# Altium schematic sheet ESP8266_Amp_THT.SchDoc
size A4; PageSetup: Record=PageOptions|CenterHorizontal=True|CenterVertical=True|PrintScale=1.00|XCorrection=1.00|YCorrection=1.00|PrintKind=1|BorderSize=5000000|LeftOffset=0|BottomOffset=0|Orientation=2|PaperLength=1000|PaperWidth=1000|Scale=100|PaperSource=7|PrintQuality=600|MediaType=1|DitherType=10|PrintScaleMode=1|PaperKind=A4|PaperIndex=9
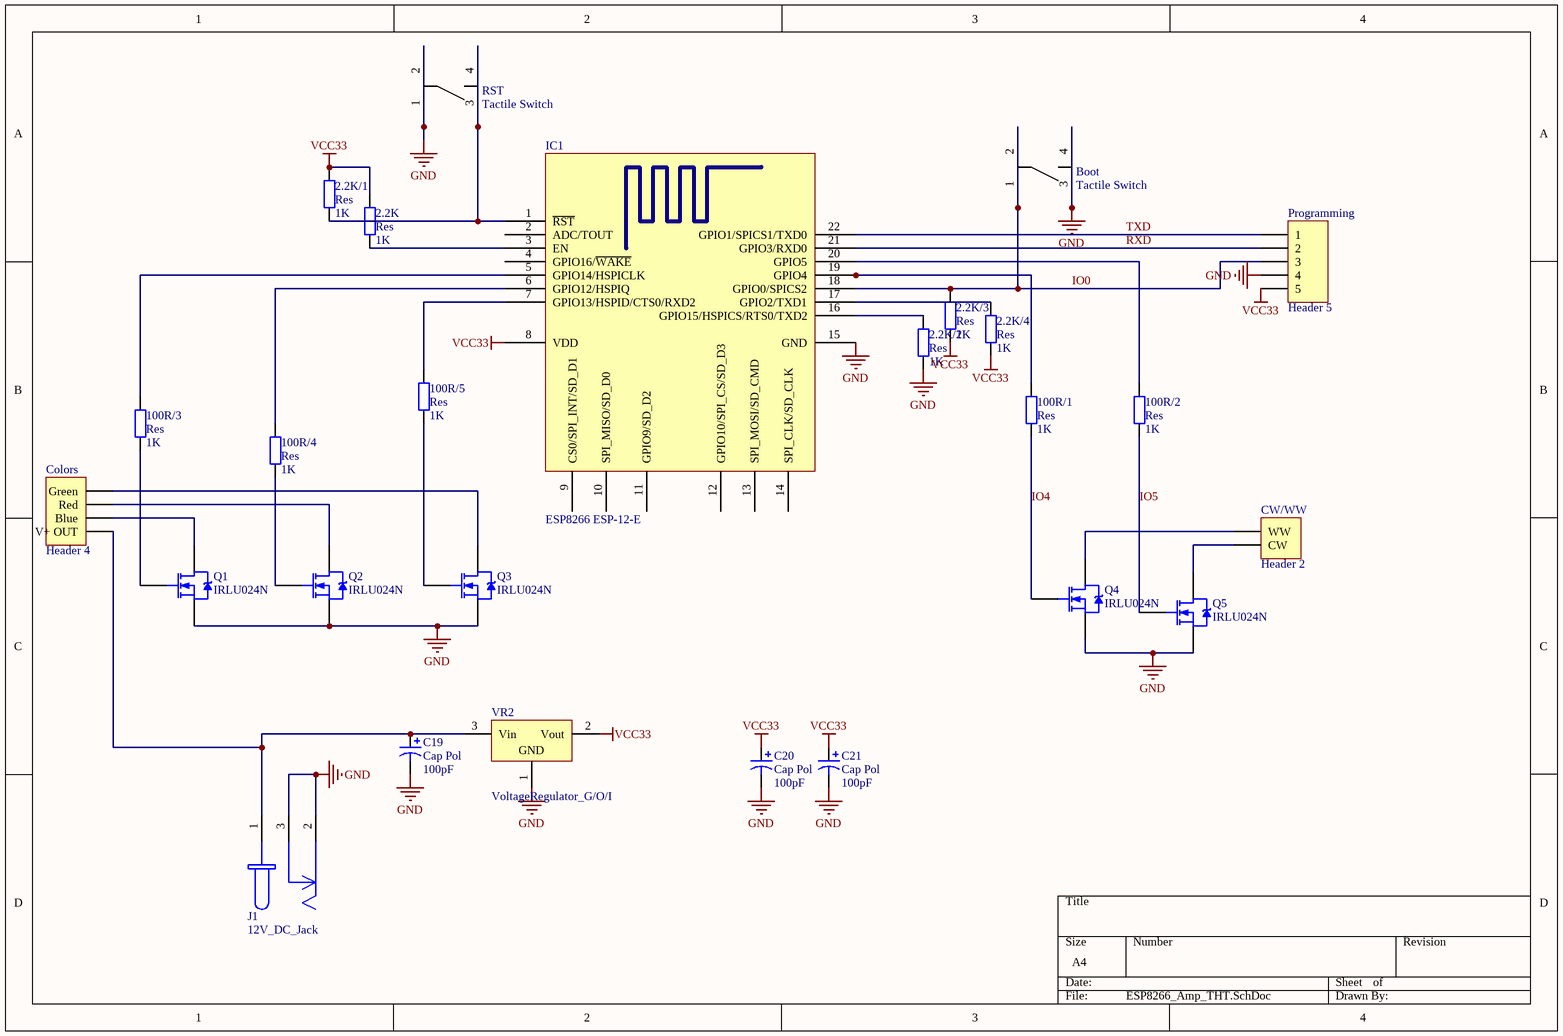
[diagram p0: ESP8266_Amp_THT.SchDoc]

## Parts
2.2K  Res  value 1K  [Res-1/4W]
2.2K/1  Res  value 1K  [Res-1/4W]
2.2K/2  Res  value 1K  [Res-1/4W]
2.2K/3  Res  value 1K  [Res-1/4W]
2.2K/4  Res  value 1K  [Res-1/4W]
100R/1  Res  value 1K  [Res-1/4W]
100R/2  Res  value 1K  [Res-1/4W]
100R/3  Res  value 1K  [Res-1/4W]
100R/4  Res  value 1K  [Res-1/4W]
100R/5  Res  value 1K  [Res-1/4W]
Boot  Tactile Switch  [Tactile-SW]
C19  Cap Pol  value 100pF  [CAPR-2.54mm]
C20  Cap Pol  value 100pF  [CAPR-2.54mm]
C21  Cap Pol  value 100pF  [CAPR-2.54mm]
Colors  Header 4  [HDR1X4]
CW/WW  Header 2  [HDR1X2]
IC1  ESP8266 ESP-12-E  [ESP8266 ESP-12-E]
J1  12V_DC_Jack  [694106301002]
Programming  Header 5  [HDR1X5]
Q1  IRLU024N  [TO-251AA]
Q2  IRLU024N  [TO-251AA]
Q3  IRLU024N  [TO-251AA]
Q4  IRLU024N  [TO-251AA]
Q5  IRLU024N  [TO-251AA]
RST  Tactile Switch  [Tactile-SW]
VR2  VoltageRegulator_G/O/I  [TO-220AB]

## Nets
GND: 2.2K/2.1 Boot.3 Boot.4 C19.1 C20.1 C21.1 IC1.15(GND) J1.2 J1.3 Programming.4 Q1.3(S) Q2.3(S) Q3.3(S) Q4.3(S) Q5.3(S) RST.1 RST.2 VR2.1(GND)
VCC33: 2.2K.2 2.2K/1.2 2.2K/3.1 2.2K/4.1 C20.2 C21.2 IC1.8(VDD) Programming.5 VR2.2(Vout)
IO0: 2.2K/3.2 Boot.1 Boot.2 IC1.18(GPIO0/SPICS2) Programming.3
IO4: 100R/1.1 Q4.1(G)
IO5: 100R/2.1 Q5.1(G)
RXD: IC1.21(GPIO3/RXD0) Programming.2
TXD: IC1.22(GPIO1/SPICS1/TXD0) Programming.1
Net2.2K/1_1: 2.2K/1.1 IC1.1(~{RST}) RST.3 RST.4
Net2.2K/2_2: 2.2K/2.2 IC1.16(GPIO15/HSPICS/RTS0/TXD2)
Net2.2K/4_2: 2.2K/4.2 IC1.17(GPIO2/TXD1)
Net2.2K_1: 2.2K.1 IC1.3(EN)
Net100R/1_2: 100R/1.2 IC1.19(GPIO4)
Net100R/2_2: 100R/2.2 IC1.20(GPIO5)
Net100R/3_1: 100R/3.1 Q1.1(G)
Net100R/3_2: 100R/3.2 IC1.5(GPIO14/HSPICLK)
Net100R/4_1: 100R/4.1 Q2.1(G)
Net100R/4_2: 100R/4.2 IC1.6(GPIO12/HSPIQ)
Net100R/5_1: 100R/5.1 Q3.1(G)
Net100R/5_2: 100R/5.2 IC1.7(GPIO13/HSPID/CTS0/RXD2)
NetC19_2: C19.2 Colors.1(V+_OUT) J1.1 VR2.3(Vin)
NetColors_2: Colors.2(Blue) Q1.2(D)
NetColors_3: Colors.3(Red) Q2.2(D)
NetColors_4: Colors.4(Green) Q3.2(D)
NetCW/WW_1: CW/WW.1(WW) Q4.2(D)
NetCW/WW_2: CW/WW.2(CW) Q5.2(D)

Not connected (* = marked no-connect by the designer): IC1 2(ADC/TOUT) 4(GPIO16/~{WAKE}) 9(CS0/SPI_INT/SD_D1) 10(SPI_MISO/SD_D0) 11(GPIO9/SD_D2) 12(GPIO10/SPI_CS/SD_D3) 13(SPI_MOSI/SD_CMD) 14(SPI_CLK/SD_CLK)

## Library data of the parts
2.2K 2.2K/1-2.2K/4 100R/1-100R/5 = Res: Resistor; Published: 8-Jun-2000; LatestRevisionDate: 17-Jul-2002; LatestRevisionNote: Re-released for DXP Platform.; PackageReference: AXIAL-0.4; Publisher: Altium Limited; PackageDescription: Axial Device, Thru-Hole; 2 Leads; 0.4 in Pin Spacing
Boot RST = Tact_SW: Value: 1K; Published: 8-Jun-2000; LatestRevisionDate: 17-Jul-2002; LatestRevisionNote: Re-released for DXP Platform.; PackageReference: AXIAL-0.4; Publisher: Altium Limited; PackageDescription: Axial Device, Thru-Hole; 2 Leads; 0.4 in Pin Spacing
C19-C21 = Cap Pol: Polarized Capacitor (Axial); Published: 8-Jun-2000; LatestRevisionDate: 17-Jul-2002; LatestRevisionNote: Re-released for DXP Platform.; PackageReference: POLAR0.8; Publisher: Altium Limited; PackageDescription: Polarized Capacitor; 2 Leads
Colors = Header 4: Header, 4-Pin; LatestRevisionDate: 17-Jul-2002; LatestRevisionNote: Re-released for DXP Platform.; Publisher: Altium Limited
CW/WW = Header 2: Header, 2-Pin; LatestRevisionDate: 17-Jul-2002; LatestRevisionNote: Re-released for DXP Platform.; Publisher: Altium Limited
J1 = 12V_DC_Jack: WR-DC DC Power Jack Right Angled(6.4); Published: June 2016; Publisher: Wurth Elektronik; ComponentLink1Description: Manufacturer; ComponentLink1URL: http://www.we-online.de; ComponentLink2Description: Datasheet; ComponentLink2URL: http://katalog.we-online.de/em/datasheet/6941xx301002.pdf; PartNumber: 694106301002
Programming = Header 5: Header, 5-Pin; LatestRevisionDate: 17-Jul-2002; LatestRevisionNote: Re-released for DXP Platform.; Publisher: Altium Limited
Q1-Q5 = IRLU024N: HEXFET Power MOSFET; Note: Pin 2 is electrically connected to pin 4.; Published: 8-Jun-2000; LatestRevisionDate: 17-Jul-2002; LatestRevisionNote: Re-released for DXP Platform.; PackageReference: TO-251AA; Publisher: Altium Limited; PackageDescription: TO, Thru-Hole, Vertical, Heatsink Mounted; 3 In-Line Leads; Pitch 2.28 mm; ComponentLink1Description: Manufacturer Link; ComponentLink1URL: http://www.irf.com/; ComponentLink2Description: Datasheet; ComponentLink2URL: http://www.irf.com/product-info/datasheets/data/irlr024n.pdf
VR2 = VoltageRegulator_G/O/I: Voltage Regulator; Published: 24-Mar-1999; LatestRevisionDate: 29-May-2009; LatestRevisionNote: IPC-7351 Footprint Added.; PackageReference: D2PAK; Publisher: Altium Limited; PackageDescription: 3-Pin Transistor Outline Package 2.54 mm Pitch, 15.1 mm Lead Span